# Altium project BEAGLEPLAYV020_220915.PrjPcb (part 9 of 10)

## Sheet 019_CC1352P.SchDoc
size 420 x 297 mm; Page Create Date: May 29, 2006; WebSite: https://www.seeedstudio.com; Variant Name: <Core Design>; Page Number: 19; Drawing: qxn; Schematic Name: BeaglePlay; Page Size: A3; Comment: Seeed Title; Page Count: 22; Page Name: 019_CC1352P; Company: Seeed Studio; RevCode: v0.2; DsnPath: C:\Users\a0488739\Documents\GitHub\beagleplay\allegro\DVT\BEAGLEPLAYV020_220915.DSN; SchematicName: BeaglePlay; PageName: 019_CC1352P; PageSize: A3; TopSchematic: True
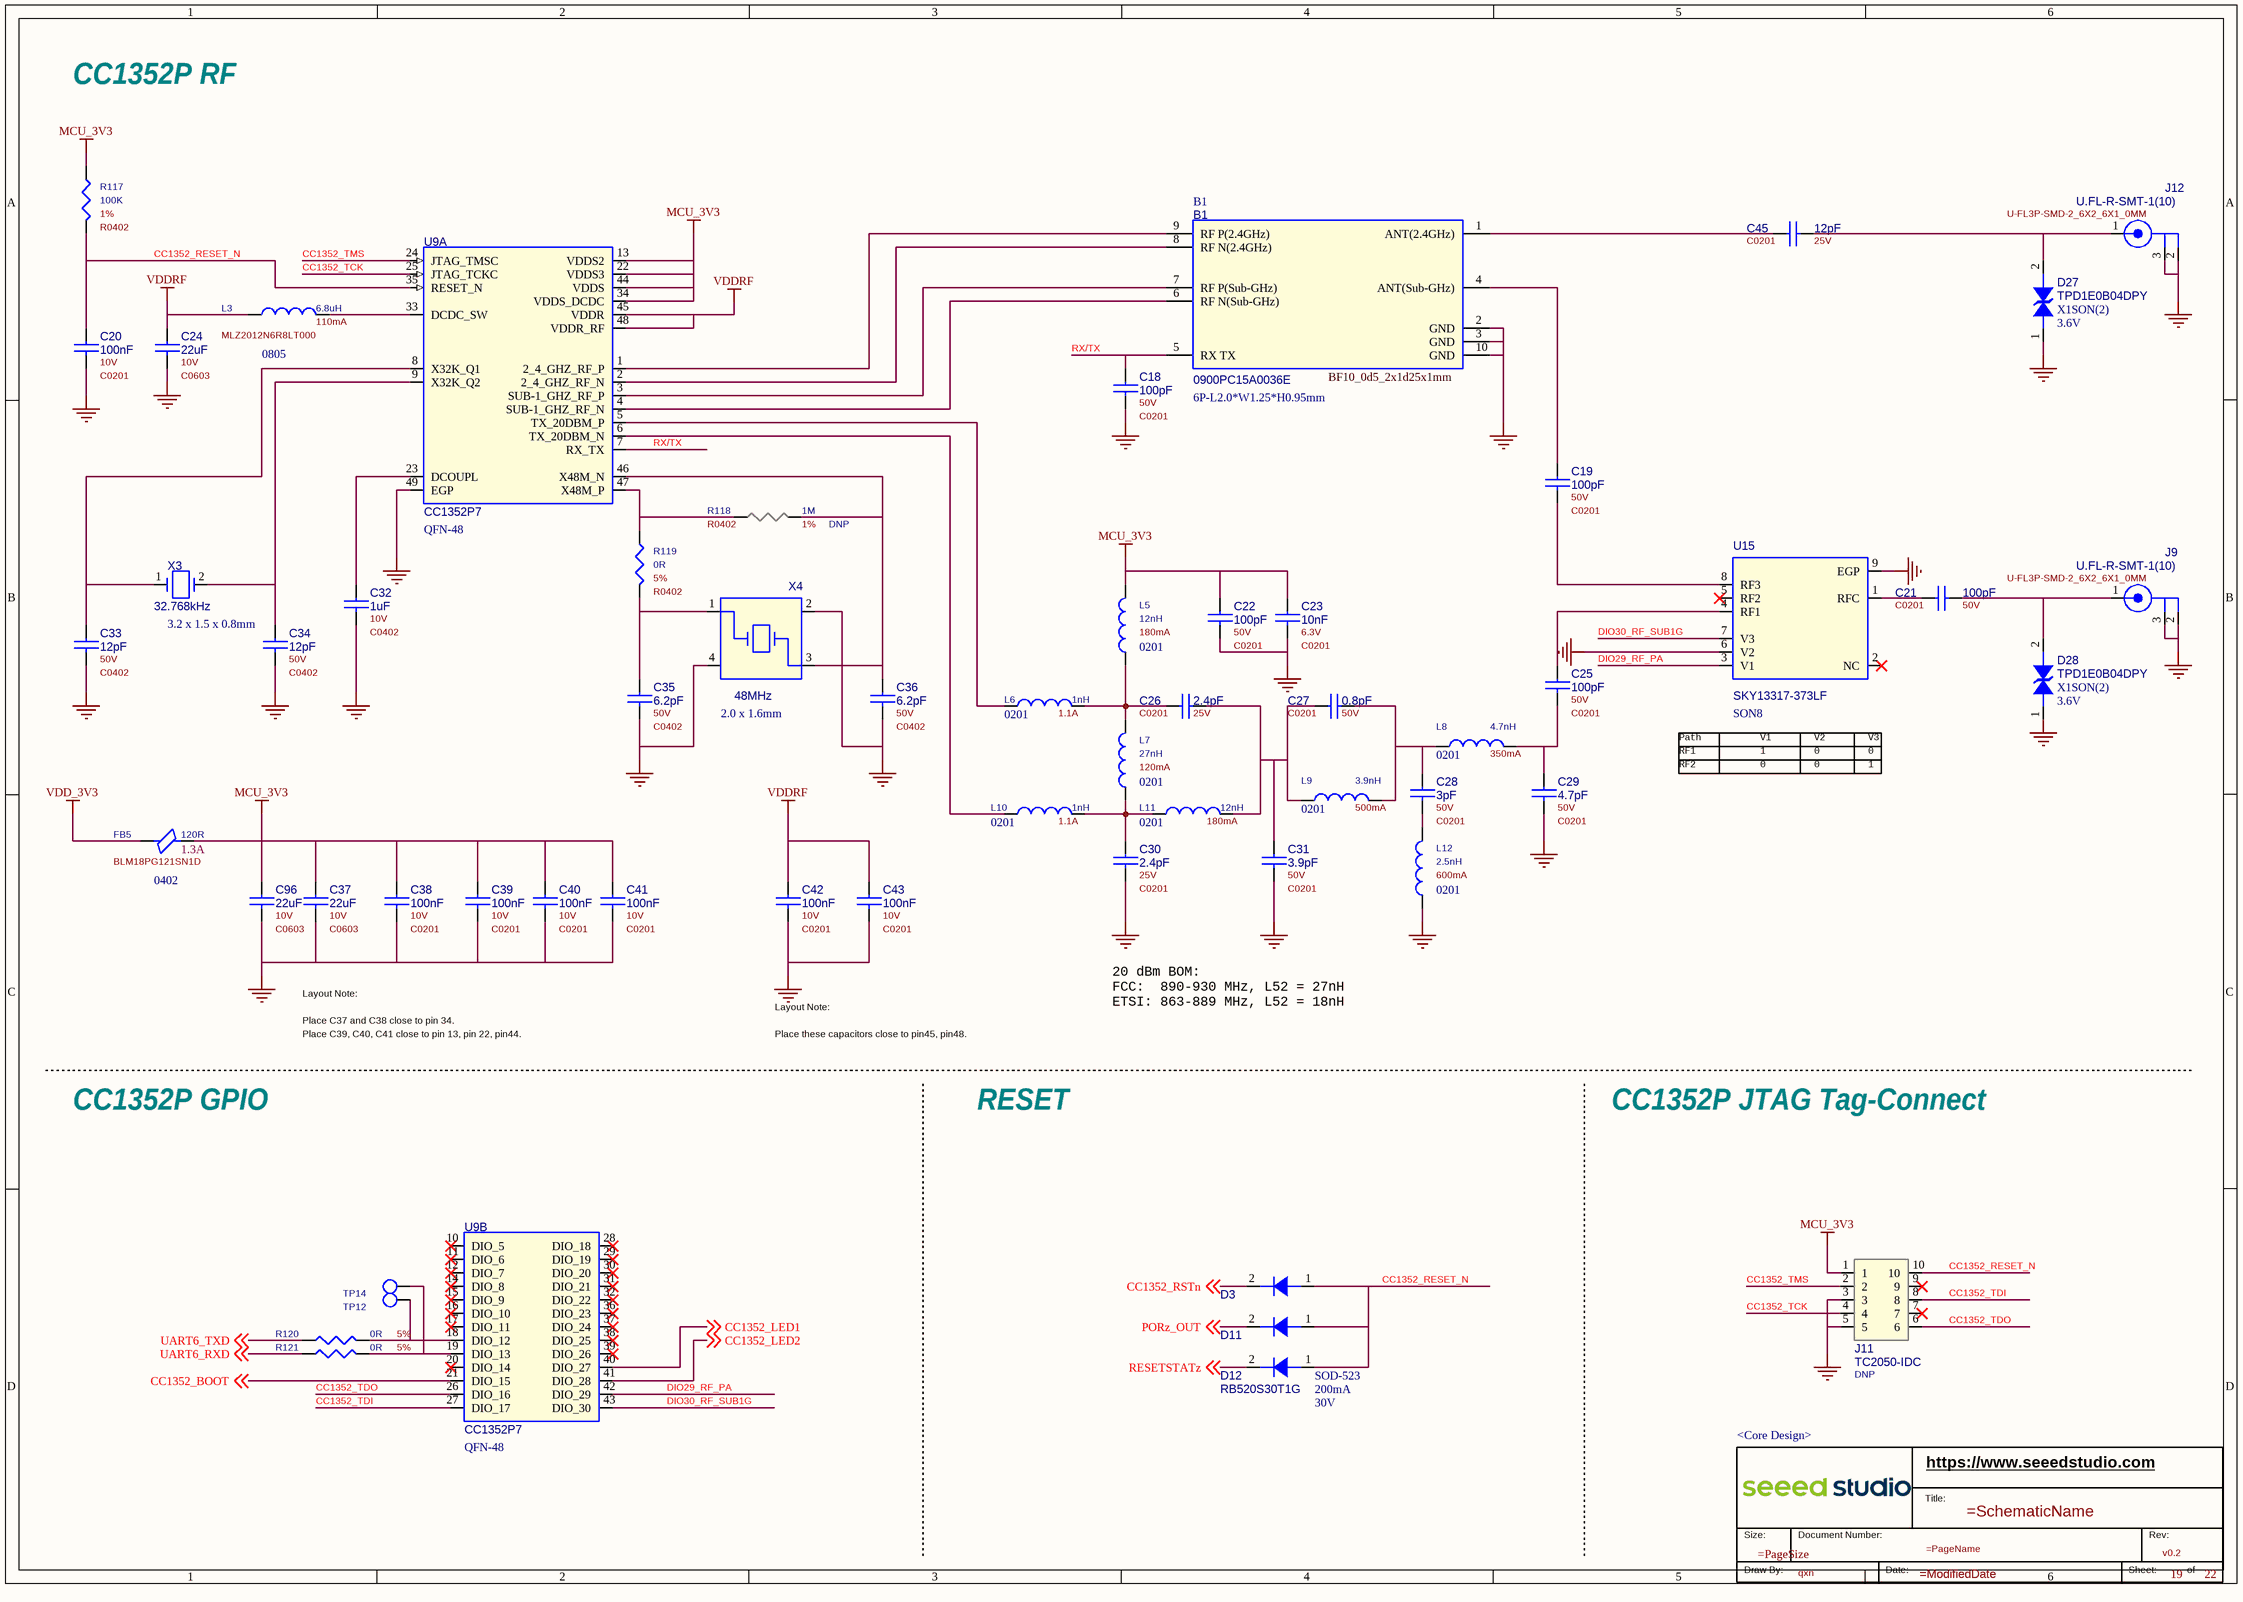
[diagram p18: 019_CC1352P.SchDoc]

### Parts
(Parts that share a designator on the sheet are numbered #1, #2 ... from top to bottom, then left to right.)
*#19  RevCode: v0.2  Page Number: 19  Page Count: 22  Drawing: qxn  Variant Name: <Core Design>  (hidden comment: Seeed Title)  (graphical)
B1  Reference: B1  Package Size: 6P-L2.0*W1.25*H0.95mm  [BF10_0d5_2x1d25x1mm]  (hidden comment: 0900PC15A0036E)
C18  value 100pF  Rating: 50V  [C0201]  (hidden comment: CC)
C19  value 100pF  Rating: 50V  [C0201]  (hidden comment: CC)
C20  value 100nF  Rating: 10V  [C0201]  (hidden comment: CC)
C21  value 100pF  Rating: 50V  [C0201]  (hidden comment: CC)
C22  value 100pF  Rating: 50V  [C0201]  (hidden comment: CC)
C23  value 10nF  Rating: 6.3V  [C0201]  (hidden comment: CC)
C24  value 22uF  Rating: 10V  [C0603]  (hidden comment: CC)
C25  value 100pF  Rating: 50V  [C0201]  (hidden comment: CC)
C26  value 2.4pF  Rating: 25V  [C0201]  (hidden comment: CC)
C27  value 0.8pF  Rating: 50V  [C0201]  (hidden comment: CC)
C28  value 3pF  Rating: 50V  [C0201]  (hidden comment: CC)
C29  value 4.7pF  Rating: 50V  [C0201]  (hidden comment: CC)
C30  value 2.4pF  Rating: 25V  [C0201]  (hidden comment: CC)
C31  value 3.9pF  Rating: 50V  [C0201]  (hidden comment: CC)
C32  value 1uF  Rating: 10V  [C0402]  (hidden comment: CC)
C33  value 12pF  Rating: 50V  [C0402]  (hidden comment: CC)
C34  value 12pF  Rating: 50V  [C0402]  (hidden comment: CC)
C35  value 6.2pF  Rating: 50V  [C0402]  (hidden comment: CC)
C36  value 6.2pF  Rating: 50V  [C0402]  (hidden comment: CC)
C37  value 22uF  Rating: 10V  [C0603]  (hidden comment: CC)
C38  value 100nF  Rating: 10V  [C0201]  (hidden comment: CC)
C39  value 100nF  Rating: 10V  [C0201]  (hidden comment: CC)
C40  value 100nF  Rating: 10V  [C0201]  (hidden comment: CC)
C41  value 100nF  Rating: 10V  [C0201]  (hidden comment: CC)
C42  value 100nF  Rating: 10V  [C0201]  (hidden comment: CC)
C43  value 100nF  Rating: 10V  [C0201]  (hidden comment: CC)
C45  value 12pF  Rating: 25V  [C0201]  (hidden comment: CC)
C96  value 22uF  Rating: 10V  [C0603]  (hidden comment: CC)
D3  D  [sod_523]  (value not drawn)
D11  D  [sod_523]  (value not drawn)
D12  value RB520S30T1G  Package Size: SOD-523  Peak Forward Current: 200mA  Repetitive Reverse Voltage Maximum: 30V  [sod_523]  (hidden comment: D)
D27  value TPD1E0B04DPY  Package Size: X1SON(2)  Rated Voltage: 3.6V  [x1son2_0d65_1x0_6x0_45mm]  (hidden comment: DIODE TVS BI-DIR)
D28  value TPD1E0B04DPY  Package Size: X1SON(2)  Rated Voltage: 3.6V  [x1son2_0d65_1x0_6x0_45mm]  (hidden comment: DIODE TVS BI-DIR)
FB5  value 120R  Rating: 1.3A  Manufacturer Part Number: BLM18PG121SN1D  Package Size: 0402  [L0402]  (hidden comment: FB)
J9  value U.FL-R-SMT-1(10)  [U-FL3P-SMD-2_6X2_6X1_0MM]  (hidden comment: RF ANT 3P)
J11  value TC2050-IDC  ASSY: DNP  [Connect10_1d27_12_4x6_7mm]  (hidden comment: Header 2X5_1)
J12  value U.FL-R-SMT-1(10)  [U-FL3P-SMD-2_6X2_6X1_0MM]  (hidden comment: RF ANT 3P)
L3  value 6.8uH  Manufacturer Part Number: MLZ2012N6R8LT000  Rating: 110mA  Package Size: 0805  [L0805]  (hidden comment: L)
L5  value 12nH  Rating: 180mA  Package Size: 0201  [L0201]  (hidden comment: L)
L6  value 1nH  Rating: 1.1A  Package Size: 0201  [L0201]  (hidden comment: L)
L7  value 27nH  Rating: 120mA  Package Size: 0201  [L0201]  (hidden comment: L)
L8  value 4.7nH  Rating: 350mA  Package Size: 0201  [L0201]  (hidden comment: L)
L9  value 3.9nH  Rating: 500mA  Package Size: 0201  [L0201]  (hidden comment: L)
L10  value 1nH  Rating: 1.1A  Package Size: 0201  [L0201]  (hidden comment: L)
L11  value 12nH  Rating: 180mA  Package Size: 0201  [L0201]  (hidden comment: L)
L12  value 2.5nH  Rating: 600mA  Package Size: 0201  [L0201]  (hidden comment: L)
R117  value 100K  Rating: 1%  [R0402]  (hidden comment: R)
R118  value 1M  Rating: 1%  ASSY: DNP  [R0402]  (hidden comment: R)
R119  value 0R  Rating: 5%  [R0402]  (hidden comment: R)
R120  value 0R  Rating: 5%  [R0402]  (hidden comment: R)
R121  value 0R  Rating: 5%  [R0402]  (hidden comment: R)
TP12  Test Point  [tp1-8040]  (value not drawn)
TP14  Test Point  [tp1-8040]  (value not drawn)
U9  value CC1352P7  Package Size: QFN-48  [qfn48_0d5_7x7mm]  (hidden comment: CC1352P1F3RGZ)  (parts A,B of 2)
U15  Package Size: SON8  [son8p_150x150x50mm]  (hidden comment: SKY13317-373LF)
X3  value 32.768kHz  Package Size: 3.2 x 1.5 x 0.8mm  [X2_SMD_3_2X1_5MM]  (hidden comment: XTAL_2P)
X4  value 48MHz  Package Size: 2.0 x 1.6mm  [x4_smd_2_0x1_6mm]  (hidden comment: XTAL_4P)

### Nets
GND: B1.2(GND) B1.3(GND) B1.10(GND) C18.2 C20.2 C22.2 C23.2 C24.2 C29.2 C30.2 C31.2 C32.2 C33.2 C34.2 C35.2 C36.2 C37.2 C38.2 C39.2 C40.2 C41.2 C42.2 C43.2 C96.2 D27.1 D28.1 J9.2(SHIELD1) J9.3(SHIELD2) J11.3 J11.5 J12.2(SHIELD1) J12.3(SHIELD2) L12.1 U9.49(EGP) U15.6(V2) U15.9(EGP) X4.2 X4.4
MCU_3V3: C22.1 C23.1 C37.1 C38.1 C39.1 C40.1 C41.1 C96.1 FB5.2 J11.1 L5.2 R117.1 U9.13(VDDS2) U9.22(VDDS3) U9.34(VDDS_DCDC) U9.44(VDDS)
VDD_3V3: FB5.1
VDDRF: C24.1 C42.1 C43.1 L3.1 U9.45(VDDR) U9.48(VDDR_RF)
CC1352_BOOT: U9.21(DIO_15) ; off-sheet CC1352_BOOT
CC1352_LED1: U9.40(DIO_27) ; off-sheet CC1352_LED1
CC1352_LED2: U9.41(DIO_28) ; off-sheet CC1352_LED2
CC1352_RESET_N: C20.1 D3.1(A) D11.1(A) D12.1(A) J11.10 R117.2 U9.35(RESET_N)
CC1352_RSTn: D3.2(C) ; off-sheet CC1352_RSTn
CC1352_TCK: J11.4 U9.25(JTAG_TCKC)
CC1352_TDI: J11.8 U9.27(DIO_17)
CC1352_TDO: J11.6 U9.26(DIO_16)
CC1352_TMS: J11.2 U9.24(JTAG_TMSC)
DIO29_RF_PA: U9.42(DIO_29) U15.3(V1)
DIO30_RF_SUB1G: U9.43(DIO_30) U15.7(V3)
PORz_OUT: D11.2(C) ; off-sheet PORz_OUT
RESETSTATz: D12.2(C) ; off-sheet RESETSTATz
RX/TX: B1.5(RX_TX) C18.1 U9.7(RX_TX)
UART6_RXD: R121.1 ; off-sheet UART6_RXD
UART6_TXD: R120.1 ; off-sheet UART6_TXD
NetB1_1: B1.1(ANT(2.4GHz)) C45.1
NetB1_4: B1.4(ANT(Sub-GHz)) C19.1
NetB1_6: B1.6(RF_N(Sub-GHz)) U9.4(SUB-1_GHZ_RF_N)
NetB1_7: B1.7(RF_P(Sub-GHz)) U9.3(SUB-1_GHZ_RF_P)
NetB1_8: B1.8(RF_N(2.4GHz)) U9.2(2_4_GHZ_RF_N)
NetB1_9: B1.9(RF_P(2.4GHz)) U9.1(2_4_GHZ_RF_P)
NetC19_2: C19.2 U15.8(RF3)
NetC21_1: C21.1 U15.1(RFC)
NetC21_2: C21.2 D28.2 J9.1(CENTER)
NetC25_1: C25.1 U15.4(RF1)
NetC25_2: C25.2 C29.1 L8.2
NetC26_1: C26.1 L5.1 L6.2 L7.2
NetC26_2: C26.2 C27.1 C31.1 L9.1 L11.2
NetC27_2: C27.2 C28.1 L8.1 L9.2
NetC28_2: C28.2 L12.2
NetC30_1: C30.1 L7.1 L10.2 L11.1
NetC32_1: C32.1 U9.23(DCOUPL)
NetC33_1: C33.1 U9.8(X32K_Q1) X3.1
NetC34_1: C34.1 U9.9(X32K_Q2) X3.2
NetC35_1: C35.1 R119.2 X4.1
NetC36_1: C36.1 R118.2 U9.46(X48M_N) X4.3
NetC45_2: C45.2 D27.2 J12.1(CENTER)
NetL3_2: L3.2 U9.33(DCDC_SW)
NetL6_1: L6.1 U9.5(TX_20DBM_P)
NetL10_1: L10.1 U9.6(TX_20DBM_N)
NetR118_1: R118.1 R119.1 U9.47(X48M_P)
NetR120_2: R120.2 TP12.1(TP) U9.18(DIO_12)
NetR121_2: R121.2 TP14.1(TP) U9.19(DIO_13)

Not connected (* = marked no-connect by the designer): J11 7* 9*; U9 10(DIO_5)* 11(DIO_6)* 12(DIO_7)* 14(DIO_8)* 15(DIO_9)* 16(DIO_10)* 17(DIO_11)* 20(DIO_14)* 28(DIO_18)* 29(DIO_19)* 30(DIO_20)* 31(DIO_21)* 32(DIO_22)* 36(DIO_23)* 37(DIO_24)* 38(DIO_25)* 39(DIO_26)*; U15 2(NC)* 5(RF2)*

### Notes on the sheet
- CC1352P RF
- Path
- RF1
- RF2
- V1
- 0
- 1
- V2
- V3
- Layout Note:
- 20 dBm BOM:
  FCC:  890-930 MHz, L52 = 27nH
  ETSI: 863-889 MHz, L52 = 18nH
- Place C39, C40, C41 close to pin 13, pin 22, pin44.
- Place C37 and C38 close to pin 34.
- Place these capacitors close to pin45, pin48.
- CC1352P GPIO
- RESET
- CC1352P JTAG Tag-Connect
- (in symbol Seeed Title) https://www.seeedstudio.com; Title:; Size:; Document Number:; Rev:; Draw By:; Date:; Sheet:; of

### Library data of the parts
*#19 = Seeed Title: Company: Seeed Studio; WebSite: https://www.seeedstudio.com; Schematic Name: =SchematicName; Page Size: =PageSize; Page Name: =PageName; Page Create Date: May 29, 2006; Page Modify Date: =ModifiedDate
B1 = 0900PC15A0036E: MISC, Balun, 0900PC15A0036E, SMD, 6P-L2.0*W1.25*H0.95mm; Manufacturer: Johanson; Company Part Status: BeaglePlay; PN: 310060581; CLASS: DISCRETE; PCB Footprint: BF10_0d5_2x1d25x1mm; Value: 0900PC15A0036E; Part Reference: B1; Manufacturer Part Number: 0900PC15A0036E; Manufacturer PN: 0900PC15A0036E
C18 = CC: CAP, Ceramic, SMD, 100pF, 5%, 50V, 0201; Part Reference: C18; Manufacturer PN: CC0201JRNPO9BN101; Company Part Status: BeaglePlay; Manufacturer Part Number: CC0402JRNPO9BN101; Manufacturer: YAGEO; CLASS: DISCRETE; PN: 302010420; Temperature Coefficient: NPO; PCB Footprint: C0201; Tolerance: 5%; Dielectric Type: Ceramic; Package Size: 0201; Temperature: -55¡ãC to 125¡ãC; Status: Testo PoE; Part Type: Ceramic
C19 = CC: CAP, Ceramic, SMD, 100pF, 5%, 50V, 0201; Part Reference: C19; Manufacturer: YAGEO; Manufacturer Part Number: CC0402JRNPO9BN101; Company Part Status: BeaglePlay; Manufacturer PN: CC0201JRNPO9BN101; Temperature Coefficient: NPO; PN: 302010420; CLASS: DISCRETE; PCB Footprint: C0201; Part Type: Ceramic; Status: Testo PoE; Temperature: -55¡ãC to 125¡ãC; Package Size: 0201; Dielectric Type: Ceramic; Tolerance: 5%
C20 = CC: CAP, Ceramic, SMD, 100nF, 10%, 10V, 0201; Part Reference: C20; Manufacturer PN: CC0201KRX5R6BB104; Company Part Status: ODYSSEY-i.MX8M; Manufacturer Part Number: CC0402KRX7R7BB104; Manufacturer: YAGEO; CLASS: DISCRETE; Temperature Coefficient: X5R; PN: 302010271; PCB Footprint: C0201; Tolerance: 10%; Dielectric Type: Ceramic; Package Size: 0201; Temperature: -55¡ãC to 125¡ãC; Status: BeagleBone Carrier Board; Part Type: Ceramic
C21 = CC: CAP, Ceramic, SMD, 100pF, 5%, 50V, 0201; Part Reference: C21; Manufacturer PN: CC0201JRNPO9BN101; Company Part Status: BeaglePlay; Manufacturer Part Number: CC0402JRNPO9BN101; Manufacturer: YAGEO; CLASS: DISCRETE; PN: 302010420; Temperature Coefficient: NPO; PCB Footprint: C0201; Tolerance: 5%; Dielectric Type: Ceramic; Package Size: 0201; Temperature: -55¡ãC to 125¡ãC; Status: Testo PoE; Part Type: Ceramic
C22 = CC: CAP, Ceramic, SMD, 100pF, 5%, 50V, 0201; Part Reference: C22; Manufacturer PN: CC0201JRNPO9BN101; Company Part Status: BeaglePlay; Manufacturer Part Number: CC0402JRNPO9BN101; Manufacturer: YAGEO; CLASS: DISCRETE; PN: 302010420; Temperature Coefficient: NPO; PCB Footprint: C0201; Tolerance: 5%; Dielectric Type: Ceramic; Package Size: 0201; Temperature: -55¡ãC to 125¡ãC; Status: Testo PoE; Part Type: Ceramic
C23 = CC: CAP, Ceramic, SMD, 10nF, 10%, 6.3V, 0201; Part Reference: C23; Manufacturer PN: CC0201KRX5R5BB103; Company Part Status: ODYSSEY-i.MX8M; Manufacturer: YAGEO; Manufacturer Part Number: CC0402KRX7R9BB103; CLASS: DISCRETE; Temperature Coefficient: X5R; PN: 302011831; PCB Footprint: C0201; Tolerance: 10%; Dielectric Type: Ceramic; Package Size: 0201; Part Type: Ceramic; Status: BeagleBone Carrier Board; Temperature: -55¡ãC to 125¡ãC
C24 = CC: CAP, Ceramic, SMD, 22uF, 20%, 10V, 0603; Part Reference: C24; Manufacturer PN: CC0603MRX5R6BB226; Manufacturer: YAGEO; CLASS: DISCRETE; Temperature Coefficient: X5R; PN: 302010411; PCB Footprint: C0603; Tolerance: 20%; Dielectric Type: Ceramic; Package Size: 0603; Manufacturer Part Number: CC0603MRX5R6BB226; Part Type: Ceramic; Temperature: -55¡ãC to 85¡ãC
C25 = CC: CAP, Ceramic, SMD, 100pF, 5%, 50V, 0201; Part Reference: C25; Manufacturer PN: CC0201JRNPO9BN101; Company Part Status: BeaglePlay; Manufacturer Part Number: CC0402JRNPO9BN101; Manufacturer: YAGEO; CLASS: DISCRETE; PN: 302010420; Temperature Coefficient: NPO; PCB Footprint: C0201; Tolerance: 5%; Dielectric Type: Ceramic; Package Size: 0201; Temperature: -55¡ãC to 125¡ãC; Status: Testo PoE; Part Type: Ceramic
C26 = CC: CAP, Ceramic, SMD, 2.4pF, 0.25pF, 25V, 0201; Part Reference: C26; Manufacturer PN: GJM0335C1E2R4CB01D; Company Part Status: BeaglePlay; Manufacturer: Murata; Manufacturer Part Number: CC0402CRNPO9BN2R4; CLASS: DISCRETE; Temperature Coefficient: COG; PN: 302012904; PCB Footprint: C0201; Tolerance: 0.25pF; Dielectric Type: Ceramic; Package Size: 0201; Part Type: Ceramic; Status: Amazon Sidewalk Module; Temperature: -55¡ãC to 125¡ãC
C27 = CC: CAP, Ceramic, SMD, 0.8pF, 0.01pF, 50V, 0201; Part Reference: C27; Manufacturer PN: GRM0335C1HR80BA01D; Company Part Status: BeaglePlay; Manufacturer Part Number: CC0402BRNPO9BNR80; Manufacturer: Murata; CLASS: DISCRETE; Temperature Coefficient: COG; PN: 302011837; PCB Footprint: C0201; Tolerance: 0.01pF; Dielectric Type: Ceramic; Package Size: 0201; Temperature: -55¡ãC to 125¡ãC; Status: Amazon Sidewalk Module; Part Type: Ceramic
C28 = CC: CAP, Ceramic, SMD, 3pF, 0.1pF, 50V, 0201; Part Reference: C28; Manufacturer PN: CC0201BRNPO9BN3R0; Company Part Status: LR1110; Manufacturer Part Number: GRM1555C1H3R0WA01D; Manufacturer: YAGEO; CLASS: DISCRETE; Temperature Coefficient: NPO; PN: 302013024; PCB Footprint: C0201; Tolerance: 0.1pF; Dielectric Type: Ceramic; Package Size: 0201; Temperature: -55¡ãC to 125¡ãC; Status: Zola Dongle; Part Type: Ceramic
C29 = CC: CAP, Ceramic, SMD, 4.7pF, 0.25pF, 50V, 0201; Part Reference: C29; Manufacturer PN: GJM0335C1H4R7BB01D; Company Part Status: BeaglePlay; Manufacturer: Murata; Manufacturer Part Number: CC0402CRNPO9BN4R7; CLASS: DISCRETE; Temperature Coefficient: COG; PN: 302012908; PCB Footprint: C0201; Tolerance: 0.25pF; Dielectric Type: Ceramic; Package Size: 0201; Part Type: Ceramic; Status: Mini-Gateway; Temperature: -55¡ãC to 125¡ãC
C30 = CC: CAP, Ceramic, SMD, 2.4pF, 0.25pF, 25V, 0201; Part Reference: C30; Manufacturer PN: GJM0335C1E2R4CB01D; Company Part Status: BeaglePlay; Manufacturer: Murata; Manufacturer Part Number: CC0402CRNPO9BN2R4; CLASS: DISCRETE; Temperature Coefficient: COG; PN: 302012904; PCB Footprint: C0201; Tolerance: 0.25pF; Dielectric Type: Ceramic; Package Size: 0201; Part Type: Ceramic; Status: Amazon Sidewalk Module; Temperature: -55¡ãC to 125¡ãC
C31 = CC: CAP, Ceramic, SMD, 3.9pF, 0.1pF, 50V, 0201; Part Reference: C31; Manufacturer PN: GJM0335C1H3R9BB01D; Company Part Status: BeaglePlay; Manufacturer Part Number: GJM1555C1H3R9BB01D; Manufacturer: Murata; CLASS: DISCRETE; Temperature Coefficient: COG; PN: 302012906; PCB Footprint: C0201; Tolerance: 0.1pF; Dielectric Type: Ceramic; Package Size: 0201; Temperature: -55¡ãC to 125¡ãC; Status: Amazon Sidewalk Module; Part Type: Ceramic
C32 = CC: CAP, Ceramic, SMD, 1uF, 10%, 10V, 0402; Part Reference: C32; Manufacturer PN: CC0402KRX5R6BB105; Company Part Status: BeagleBone Carrier Board; Manufacturer: YAGEO; CLASS: DISCRETE; Temperature Coefficient: X5R; PN: 302010040; PCB Footprint: C0402; Tolerance: 10%; Dielectric Type: Ceramic; Package Size: 0402; Manufacturer Part Number: CC0402KRX5R6BB105; Part Type: Ceramic; Status: BeagleBone Carrier Board; Temperature: -55¡ãC to 85¡ãC
C33 = CC: CAP, Ceramic, SMD, 12pF, 5%, 50V, 0402; Part Reference: C33; Manufacturer PN: CC0402JRNPO9BN120; Company Part Status: BeaglePlay; Manufacturer: YAGEO; CLASS: DISCRETE; Temperature Coefficient: NPO; PN: 302010049; PCB Footprint: C0402; Tolerance: 5%; Dielectric Type: Ceramic; Package Size: 0402; Temperature: -55¡ãC to 125¡ãC; Status: Testo PoE; Part Type: Ceramic; Manufacturer Part Number: CC0402JRNPO9BN120
C34 = CC: CAP, Ceramic, SMD, 12pF, 5%, 50V, 0402; Part Reference: C34; Manufacturer PN: CC0402JRNPO9BN120; Company Part Status: BeaglePlay; Manufacturer: YAGEO; CLASS: DISCRETE; Temperature Coefficient: NPO; PN: 302010049; PCB Footprint: C0402; Tolerance: 5%; Dielectric Type: Ceramic; Package Size: 0402; Temperature: -55¡ãC to 125¡ãC; Status: Testo PoE; Part Type: Ceramic; Manufacturer Part Number: CC0402JRNPO9BN120
C35 = CC: CAP, Ceramic, SMD, 6.2pF, 0.25pF, 50V, 0402; Part Reference: C35; Manufacturer PN: GJM1555C1H6R2CB01D; Company Part Status: BeaglePlay; Manufacturer: Murata; CLASS: DISCRETE; Temperature Coefficient: C0G; PN: 302010303; PCB Footprint: C0402; Tolerance: 0.25pF; Dielectric Type: Ceramic; Package Size: 0402; Manufacturer Part Number: GJM1555C1H6R2CB01D; Part Type: Ceramic; Status: Zola Dongle; Temperature: -55¡ãC to 125¡ãC
C36 = CC: CAP, Ceramic, SMD, 6.2pF, 0.25pF, 50V, 0402; Part Reference: C36; Manufacturer PN: GJM1555C1H6R2CB01D; Company Part Status: BeaglePlay; Manufacturer: Murata; CLASS: DISCRETE; Temperature Coefficient: C0G; PN: 302010303; PCB Footprint: C0402; Tolerance: 0.25pF; Dielectric Type: Ceramic; Package Size: 0402; Manufacturer Part Number: GJM1555C1H6R2CB01D; Part Type: Ceramic; Status: Zola Dongle; Temperature: -55¡ãC to 125¡ãC
C37 = CC: CAP, Ceramic, SMD, 22uF, 20%, 10V, 0603; Part Reference: C37; Manufacturer PN: CC0603MRX5R6BB226; Manufacturer: YAGEO; CLASS: DISCRETE; Temperature Coefficient: X5R; PN: 302010411; PCB Footprint: C0603; Tolerance: 20%; Dielectric Type: Ceramic; Package Size: 0603; Manufacturer Part Number: CC0603MRX5R6BB226; Part Type: Ceramic; Temperature: -55¡ãC to 85¡ãC
C38 = CC: CAP, Ceramic, SMD, 100nF, 10%, 10V, 0201; Part Reference: C38; Manufacturer PN: CC0201KRX5R6BB104; Company Part Status: ODYSSEY-i.MX8M; Manufacturer: YAGEO; Manufacturer Part Number: CC0402KRX7R7BB104; CLASS: DISCRETE; Temperature Coefficient: X5R; PN: 302010271; PCB Footprint: C0201; Tolerance: 10%; Dielectric Type: Ceramic; Package Size: 0201; Part Type: Ceramic; Status: BeagleBone Carrier Board; Temperature: -55¡ãC to 125¡ãC
C39 = CC: CAP, Ceramic, SMD, 100nF, 10%, 10V, 0201; Part Reference: C39; Manufacturer PN: CC0201KRX5R6BB104; Company Part Status: ODYSSEY-i.MX8M; Manufacturer Part Number: CC0402KRX7R7BB104; Manufacturer: YAGEO; CLASS: DISCRETE; Temperature Coefficient: X5R; PN: 302010271; PCB Footprint: C0201; Tolerance: 10%; Dielectric Type: Ceramic; Package Size: 0201; Temperature: -55¡ãC to 125¡ãC; Status: BeagleBone Carrier Board; Part Type: Ceramic
C40 = CC: CAP, Ceramic, SMD, 100nF, 10%, 10V, 0201; Part Reference: C40; Manufacturer PN: CC0201KRX5R6BB104; Company Part Status: ODYSSEY-i.MX8M; Manufacturer Part Number: CC0402KRX7R7BB104; Manufacturer: YAGEO; CLASS: DISCRETE; Temperature Coefficient: X5R; PN: 302010271; PCB Footprint: C0201; Tolerance: 10%; Dielectric Type: Ceramic; Package Size: 0201; Temperature: -55¡ãC to 125¡ãC; Status: BeagleBone Carrier Board; Part Type: Ceramic
C41 = CC: CAP, Ceramic, SMD, 100nF, 10%, 10V, 0201; Part Reference: C41; Manufacturer PN: CC0201KRX5R6BB104; Company Part Status: ODYSSEY-i.MX8M; Manufacturer Part Number: CC0402KRX7R7BB104; Manufacturer: YAGEO; CLASS: DISCRETE; Temperature Coefficient: X5R; PN: 302010271; PCB Footprint: C0201; Tolerance: 10%; Dielectric Type: Ceramic; Package Size: 0201; Temperature: -55¡ãC to 125¡ãC; Status: BeagleBone Carrier Board; Part Type: Ceramic
C42 = CC: CAP, Ceramic, SMD, 100nF, 10%, 10V, 0201; Part Reference: C42; Manufacturer: YAGEO; Manufacturer Part Number: CC0402KRX7R7BB104; Company Part Status: ODYSSEY-i.MX8M; Manufacturer PN: CC0201KRX5R6BB104; PN: 302010271; Temperature Coefficient: X5R; CLASS: DISCRETE; PCB Footprint: C0201; Part Type: Ceramic; Status: BeagleBone Carrier Board; Temperature: -55¡ãC to 125¡ãC; Package Size: 0201; Dielectric Type: Ceramic; Tolerance: 10%
C43 = CC: CAP, Ceramic, SMD, 100nF, 10%, 10V, 0201; Part Reference: C43; Manufacturer Part Number: CC0402KRX7R7BB104; Manufacturer: YAGEO; Company Part Status: ODYSSEY-i.MX8M; Manufacturer PN: CC0201KRX5R6BB104; PN: 302010271; Temperature Coefficient: X5R; CLASS: DISCRETE; PCB Footprint: C0201; Temperature: -55¡ãC to 125¡ãC; Status: BeagleBone Carrier Board; Part Type: Ceramic; Package Size: 0201; Dielectric Type: Ceramic; Tolerance: 10%
C45 = CC: CAP, Ceramic, SMD, 12pF, 5%, 25V, 0201; Part Reference: C45; Manufacturer PN: CC0201JRNPO8BN120; Company Part Status: BeaglePlay; Manufacturer Part Number: CC0402JRNPO9BN101; Manufacturer: YAGEO; CLASS: DISCRETE; PN: 302010424; Temperature Coefficient: NPO; PCB Footprint: C0201; Tolerance: 5%; Dielectric Type: Ceramic; Package Size: 0201; Temperature: -55¡ãC to 125¡ãC; Status: Testo PoE; Part Type: Ceramic
C96 = CC: CAP, Ceramic, SMD, 22uF, 20%, 10V, 0603; Part Reference: C96; Manufacturer PN: CC0603MRX5R6BB226; Manufacturer: YAGEO; CLASS: DISCRETE; Temperature Coefficient: X5R; PN: 302010411; PCB Footprint: C0603; Tolerance: 20%; Dielectric Type: Ceramic; Package Size: 0603; Manufacturer Part Number: CC0603MRX5R6BB226; Part Type: Ceramic; Temperature: -55¡ãC to 85¡ãC
D3 = D: DIO, Schottky, RB520S30T1G, , , , SOD-523; Part Reference: D3; Manufacturer: ON; Company Part Status: SCG Vehicle Device; CLASS: DISCRETE; Repetitive Reverse Voltage Maximum: 30V; Peak Forward Current: 200mA; PN: 304020782; PCB Footprint: sod_523; Value: RB520S30T1G; Manufacturer PN: RB520S30T1G; Package Size: SOD-523
D11 = D: DIO, Schottky, RB520S30T1G, , , , SOD-523; Part Reference: D11; Manufacturer: ON; Company Part Status: SCG Vehicle Device; CLASS: DISCRETE; Repetitive Reverse Voltage Maximum: 30V; Peak Forward Current: 200mA; PN: 304020782; PCB Footprint: sod_523; Value: RB520S30T1G; Manufacturer PN: RB520S30T1G; Package Size: SOD-523
D12 = D: DIO, Schottky, RB520S30T1G, , , , SOD-523; Part Reference: D12; Company Part Status: SCG Vehicle Device; Manufacturer: ON; PN: 304020782; CLASS: DISCRETE; PCB Footprint: sod_523; Manufacturer PN: RB520S30T1G
D27 = DIODE TVS BI-DIR: DIO, ESD, TPD1E0B04DPY, --, 3.6V, --, X1SON(2); Part Reference: D27; Company Part Status: BeaglePlay; Manufacturer: TI; Manufacturer PN: TPD1E0B04DPYR; PN: 304051038; CLASS: DISCRETE; PCB Footprint: x1son2_0d65_1x0_6x0_45mm
D28 = DIODE TVS BI-DIR: DIO, ESD, TPD1E0B04DPY, --, 3.6V, --, X1SON(2); Part Reference: D28; Company Part Status: BeaglePlay; Manufacturer: TI; Manufacturer PN: TPD1E0B04DPYR; PN: 304051038; CLASS: DISCRETE; PCB Footprint: x1son2_0d65_1x0_6x0_45mm
FB5 = FB: Ferrite Bead, 120R, , 1.3A, 0402; Part Reference: FB5; Manufacturer: Murata; Company Part Status: BeagleBone Carrier Board; Manufacturer PN: BLM15PD121SN1D; PN: 303030040; CLASS: DISCRETE; PCB Footprint: L0402; Part Type: Ferrite Bead; Status: BeagleBone Carrier Board; Temperature: -55¡ãC to 125¡ãC
J9 = RF ANT 3P: CONN, RF Connector, 3P, SMD; Part Reference: J9; Manufacturer: HRS; Company Part Status: Seeed BeagleBone Green Gateway; CLASS: IO; PN: 320111077; PCB Footprint: U-FL3P-SMD-2_6X2_6X1_0MM; Manufacturer PN: U.FL-R-SMT-1(10); Package Size: 3P-L2.6*W2.6*H1.25mm
J11 = Header 2X5_1: CONN, Header, TC2050-IDC, 2*5P, SMD; Part Reference: J11; Company Part Status: RV PI; PN: TMP-43; CLASS: IO; PCB Footprint: Connect10_1d27_12_4x6_7mm
J12 = RF ANT 3P: CONN, RF Connector, 3P, SMD; Part Reference: J12; Manufacturer: HRS; Company Part Status: Seeed BeagleBone Green Gateway; CLASS: IO; PN: 320111077; PCB Footprint: U-FL3P-SMD-2_6X2_6X1_0MM; Manufacturer PN: U.FL-R-SMT-1(10); Package Size: 3P-L2.6*W2.6*H1.25mm
L3 = L: Power Inductor, 6.8uH, 20%, 110mA, 0805; Part Reference: L3; Company Part Status: BealgePlay; Manufacturer: TDK; CLASS: DISCRETE; PN: 303011320; PCB Footprint: L0805; Manufacturer PN: MLZ2012N6R8LT000; Temperature: -55¡ãC to 125¡ãC; Status: Zola Dongle; Part Type: Inductor
L5 = L: Inductor, 12nH, 3%, 180mA, 0201; Manufacturer Part Number: LQW15AN12NG00D; Part Reference: L5; Manufacturer: Murata; Company Part Status: BeaglePlay; Manufacturer PN: LQP03TG12NH02D; PN: 303011637; CLASS: DISCRETE; PCB Footprint: L0201; Part Type: Inductor; Status: Jetson Nano; Temperature: -55¡ãC to 125¡ãC
L6 = L: Inductor, 1nH, 0.05nH, 1.1A, 0201; Manufacturer Part Number: LQG15HS1N0S02D; Part Reference: L6; Manufacturer: Murata; Company Part Status: BeaglePlay; Manufacturer PN: LQP03HQ1N0W02D; PN: 303011219; CLASS: DISCRETE; PCB Footprint: L0201; Temperature: -55¡ãC to 125¡ãC; Status: Jetson Nano; Part Type: Inductor
L7 = L: Inductor, 27nH, 3%, 120mA, 0201; Manufacturer Part Number: LQW15AN18NG00; Part Reference: L7; Manufacturer: Murata; Manufacturer PN: LQP03TG27NH02D; Company Part Status: BeaglePlay; PN: 303011639; CLASS: DISCRETE; PCB Footprint: L0201; Part Type: Inductor
L8 = L: Inductor, 4.7nH, 5%, 350mA, 0201; Manufacturer Part Number: LQW15AN4N7C00D; Part Reference: L8; Manufacturer: Murata; Company Part Status: BeaglePlay; Manufacturer PN: LQP03TN4N7J02D; PN: 303010096; CLASS: DISCRETE; PCB Footprint: L0201; Part Type: Inductor; Status: Zola Dongle; Temperature: -55¡ãC to 125¡ãC
L9 = L: Inductor, 3.9nH, 0.1nH, 500mA, 0201; Manufacturer Part Number: LQW15AN3N9B00D; Part Reference: L9; Manufacturer: Murata; Company Part Status: BeaglePlay; Manufacturer PN: LQP03HQ3N9B02D; PN: 303011225; CLASS: DISCRETE; PCB Footprint: L0201; Part Type: Inductor; Status: Zola Dongle; Temperature: -55¡ãC to 125¡ãC
L10 = L: Inductor, 1nH, 0.05nH, 1.1A, 0201; Manufacturer Part Number: LQG15HS1N0S02D; Part Reference: L10; Manufacturer PN: LQP03HQ1N0W02D; Company Part Status: BeaglePlay; Manufacturer: Murata; CLASS: DISCRETE; PN: 303011219; PCB Footprint: L0201; Part Type: Inductor; Status: Jetson Nano; Temperature: -55¡ãC to 125¡ãC
L11 = L: Inductor, 12nH, 3%, 180mA, 0201; Manufacturer Part Number: LQW15AN12NG00D; Part Reference: L11; Manufacturer: Murata; Company Part Status: BeaglePlay; Manufacturer PN: LQP03TG12NH02D; PN: 303011637; CLASS: DISCRETE; PCB Footprint: L0201; Part Type: Inductor; Status: Jetson Nano; Temperature: -55¡ãC to 125¡ãC
L12 = L: Inductor, 2.5nH, 0.1nH, 600mA, 0201; Manufacturer Part Number: LQW15AN2N5B00D; Part Reference: L12; Manufacturer: Murata; Company Part Status: BeaglePlay; Manufacturer PN: LQP03HQ2N5B02D; PN: 303011636; CLASS: DISCRETE; PCB Footprint: L0201; Part Type: Inductor; Status: Amazon Sidewalk Module; Temperature: -55¡ãC to 125¡ãC
R117 = R: RES, Thick Film, 100K, 1%, 1/16W, SMD, 0402; Part Reference: R117; Manufacturer PN: RC0402FR-07100KL; Company Part Status: BeagleBone Carrier Board; Manufacturer: YAGEO; CLASS: DISCRETE; PN: 301010456; PCB Footprint: R0402; Rated Power: 1/16W; Package Size: 0402; Temperature: -55¡ãC to 155¡ãC; Status: BeagleBone Carrier Board; Part Type: RES; Manufacturer Part Number: RC0402FR-07100KL
R118 = R: RES, Thick Film, 1M, 1%, 1/16W, SMD, 0402; Part Reference: R118; Manufacturer PN: RC0402FR-071ML; Company Part Status: BeagleBone Carrier Board; Manufacturer: YAGEO; CLASS: DISCRETE; PN: 301010043; PCB Footprint: R0402; Rated Power: 1/16W; Package Size: 0402; Temperature: -55¡ãC to 155¡ãC; Status: BeagleBone Carrier Board; Part Type: RES; Manufacturer Part Number: RC0402FR-071ML
R119 = R: RES, Thick Film, 0R, 5%, 1/16W, SMD, 0402; Part Reference: R119; Manufacturer PN: RC0402JR-070RL; Company Part Status: BeagleBone Carrier Board; Manufacturer: YAGEO; CLASS: DISCRETE; PN: 301010000; PCB Footprint: R0402; Rated Power: 1/16W; Package Size: 0402; Manufacturer Part Number: RC0402JR-070RL; Part Type: RES; Status: BeagleBone Carrier Board; Temperature: -55¡ãC to 155¡ãC; Datasheet: Y:\01_Cadence_Library\05_Datasheet\301010000_YAGEO_RC0402JR-070RL_Datasheet.pdf
R120 = R: RES, Thick Film, 0R, 5%, 1/16W, SMD, 0402; Part Reference: R120; Manufacturer PN: RC0402JR-070RL; Company Part Status: BeagleBone Carrier Board; Manufacturer: YAGEO; CLASS: DISCRETE; PN: 301010000; PCB Footprint: R0402; Rated Power: 1/16W; Package Size: 0402; Datasheet: Y:\01_Cadence_Library\05_Datasheet\301010000_YAGEO_RC0402JR-070RL_Datasheet.pdf; Temperature: -55¡ãC to 155¡ãC; Status: BeagleBone Carrier Board; Part Type: RES; Manufacturer Part Number: RC0402JR-070RL
R121 = R: RES, Thick Film, 0R, 5%, 1/16W, SMD, 0402; Part Reference: R121; Manufacturer PN: RC0402JR-070RL; Company Part Status: BeagleBone Carrier Board; Manufacturer: YAGEO; CLASS: DISCRETE; PN: 301010000; PCB Footprint: R0402; Rated Power: 1/16W; Package Size: 0402; Datasheet: Y:\01_Cadence_Library\05_Datasheet\301010000_YAGEO_RC0402JR-070RL_Datasheet.pdf; Temperature: -55¡ãC to 155¡ãC; Status: BeagleBone Carrier Board; Part Type: RES; Manufacturer Part Number: RC0402JR-070RL
TP12 = Test Point: MISC, Test Point, Test Point, SMD, TP35S_SMD; Part Reference: TP12; Company Part Status: Mini-Gateway; ASSY: DNP; CLASS: DISCRETE; PCB Footprint: TP35S_SMD; Value: Test Point; Package Size: TP35S_SMD; PN: TP35S_SMD
TP14 = Test Point: MISC, Test Point, Test Point, SMD, TP35S_SMD; Part Reference: TP14; Company Part Status: Mini-Gateway; ASSY: DNP; CLASS: DISCRETE; PCB Footprint: TP35S_SMD; Value: Test Point; Package Size: TP35S_SMD; PN: TP35S_SMD
U9 = CC1352P1F3RGZ: IC, Controller, MCU, CC1352P7, QFN-48; Part Reference: U9; Manufacturer PN: CC1352P74T0RGZR; Company Part Status: BeaglePlay; Manufacturer: TI; Manufacturer Part Number: CC1352P1F3RGZT; Supply Voltage: 2.0 to 3.6V; PN: 310011579; Rating: 2.4G,SUB 1G; PCB Footprint: qfn48_0d5_7x7mm; CLASS: IC; Part Type: MCU; Status: Zola Dongle; Temperature: -40¡ãC to 85¡ãC
U15 = SKY13317-373LF: IC, Analog Devices, RF Switch, SKY13317-373LF, SON8; Part Reference: U15; Manufacturer: SKYWORKS; Company Part Status: BeaglePlay; PN: 310060642; PCB Footprint: son8p_150x150x50mm; Value: SKY13317-373LF; Temperature: -40¡ãC to 100¡ãC; Status: Zola Dongle; Part Type: Analog Switch; Manufacturer Part Number: SKY13317-373; CLASS: IC; Manufacturer PN: SKY13317-373LF
X3 = XTAL_2P: Crystal, SMD, 32.768kHz, 20 ppm, 7pF; Part Reference: X3; Manufacturer PN: FC-135 32.768KA-AG0; Company Part Status: Combox Pro; Manufacturer: EPSON; CLASS: DISCRETE; Frequency Tolerance: 20 ppm; Rating: 20ppm; PN: 306011026; PCB Footprint: X2_SMD_3_2X1_5MM; Temperature: -40¡ãC to 85¡ãC; Status: Zola Dongle; Part Type: Crystal; Manufacturer Part Number: FC-135 32.768KA-AG0
X4 = XTAL_4P: Crystal, SMD, 48MHz, 10 ppm, 7pF; Part Reference: X4; Manufacturer PN: 5NAA48000071SF50Q2; Company Part Status: MS; Manufacturer: Interquip; CLASS: DISCRETE; Frequency Tolerance: 10 ppm; Rating: 10ppm; PN: 306011062; PCB Footprint: x4_smd_2_0x1_6mm; Temperature: -40¡ãC to 85¡ãC; Status: Zola Dongle; Part Type: Crystal; Manufacturer Part Number: 5NAA48000071SF50Q2

## Sheet 020_WiFi WL1807MOD.SchDoc
size 420 x 297 mm; Page Create Date: May 29, 2006; WebSite: https://www.seeedstudio.com; Variant Name: <Core Design>; Page Number: 20; Drawing: qxn; Schematic Name: BeaglePlay; Page Size: A3; Comment: Seeed Title; Page Count: 22; Page Name: 020_WiFi WL1807MOD; Company: Seeed Studio; RevCode: v0.2; DsnPath: C:\Users\a0488739\Documents\GitHub\beagleplay\allegro\DVT\BEAGLEPLAYV020_220915.DSN; SchematicName: BeaglePlay; PageName: 020_WiFi WL1807MOD; PageSize: A3; TopSchematic: True
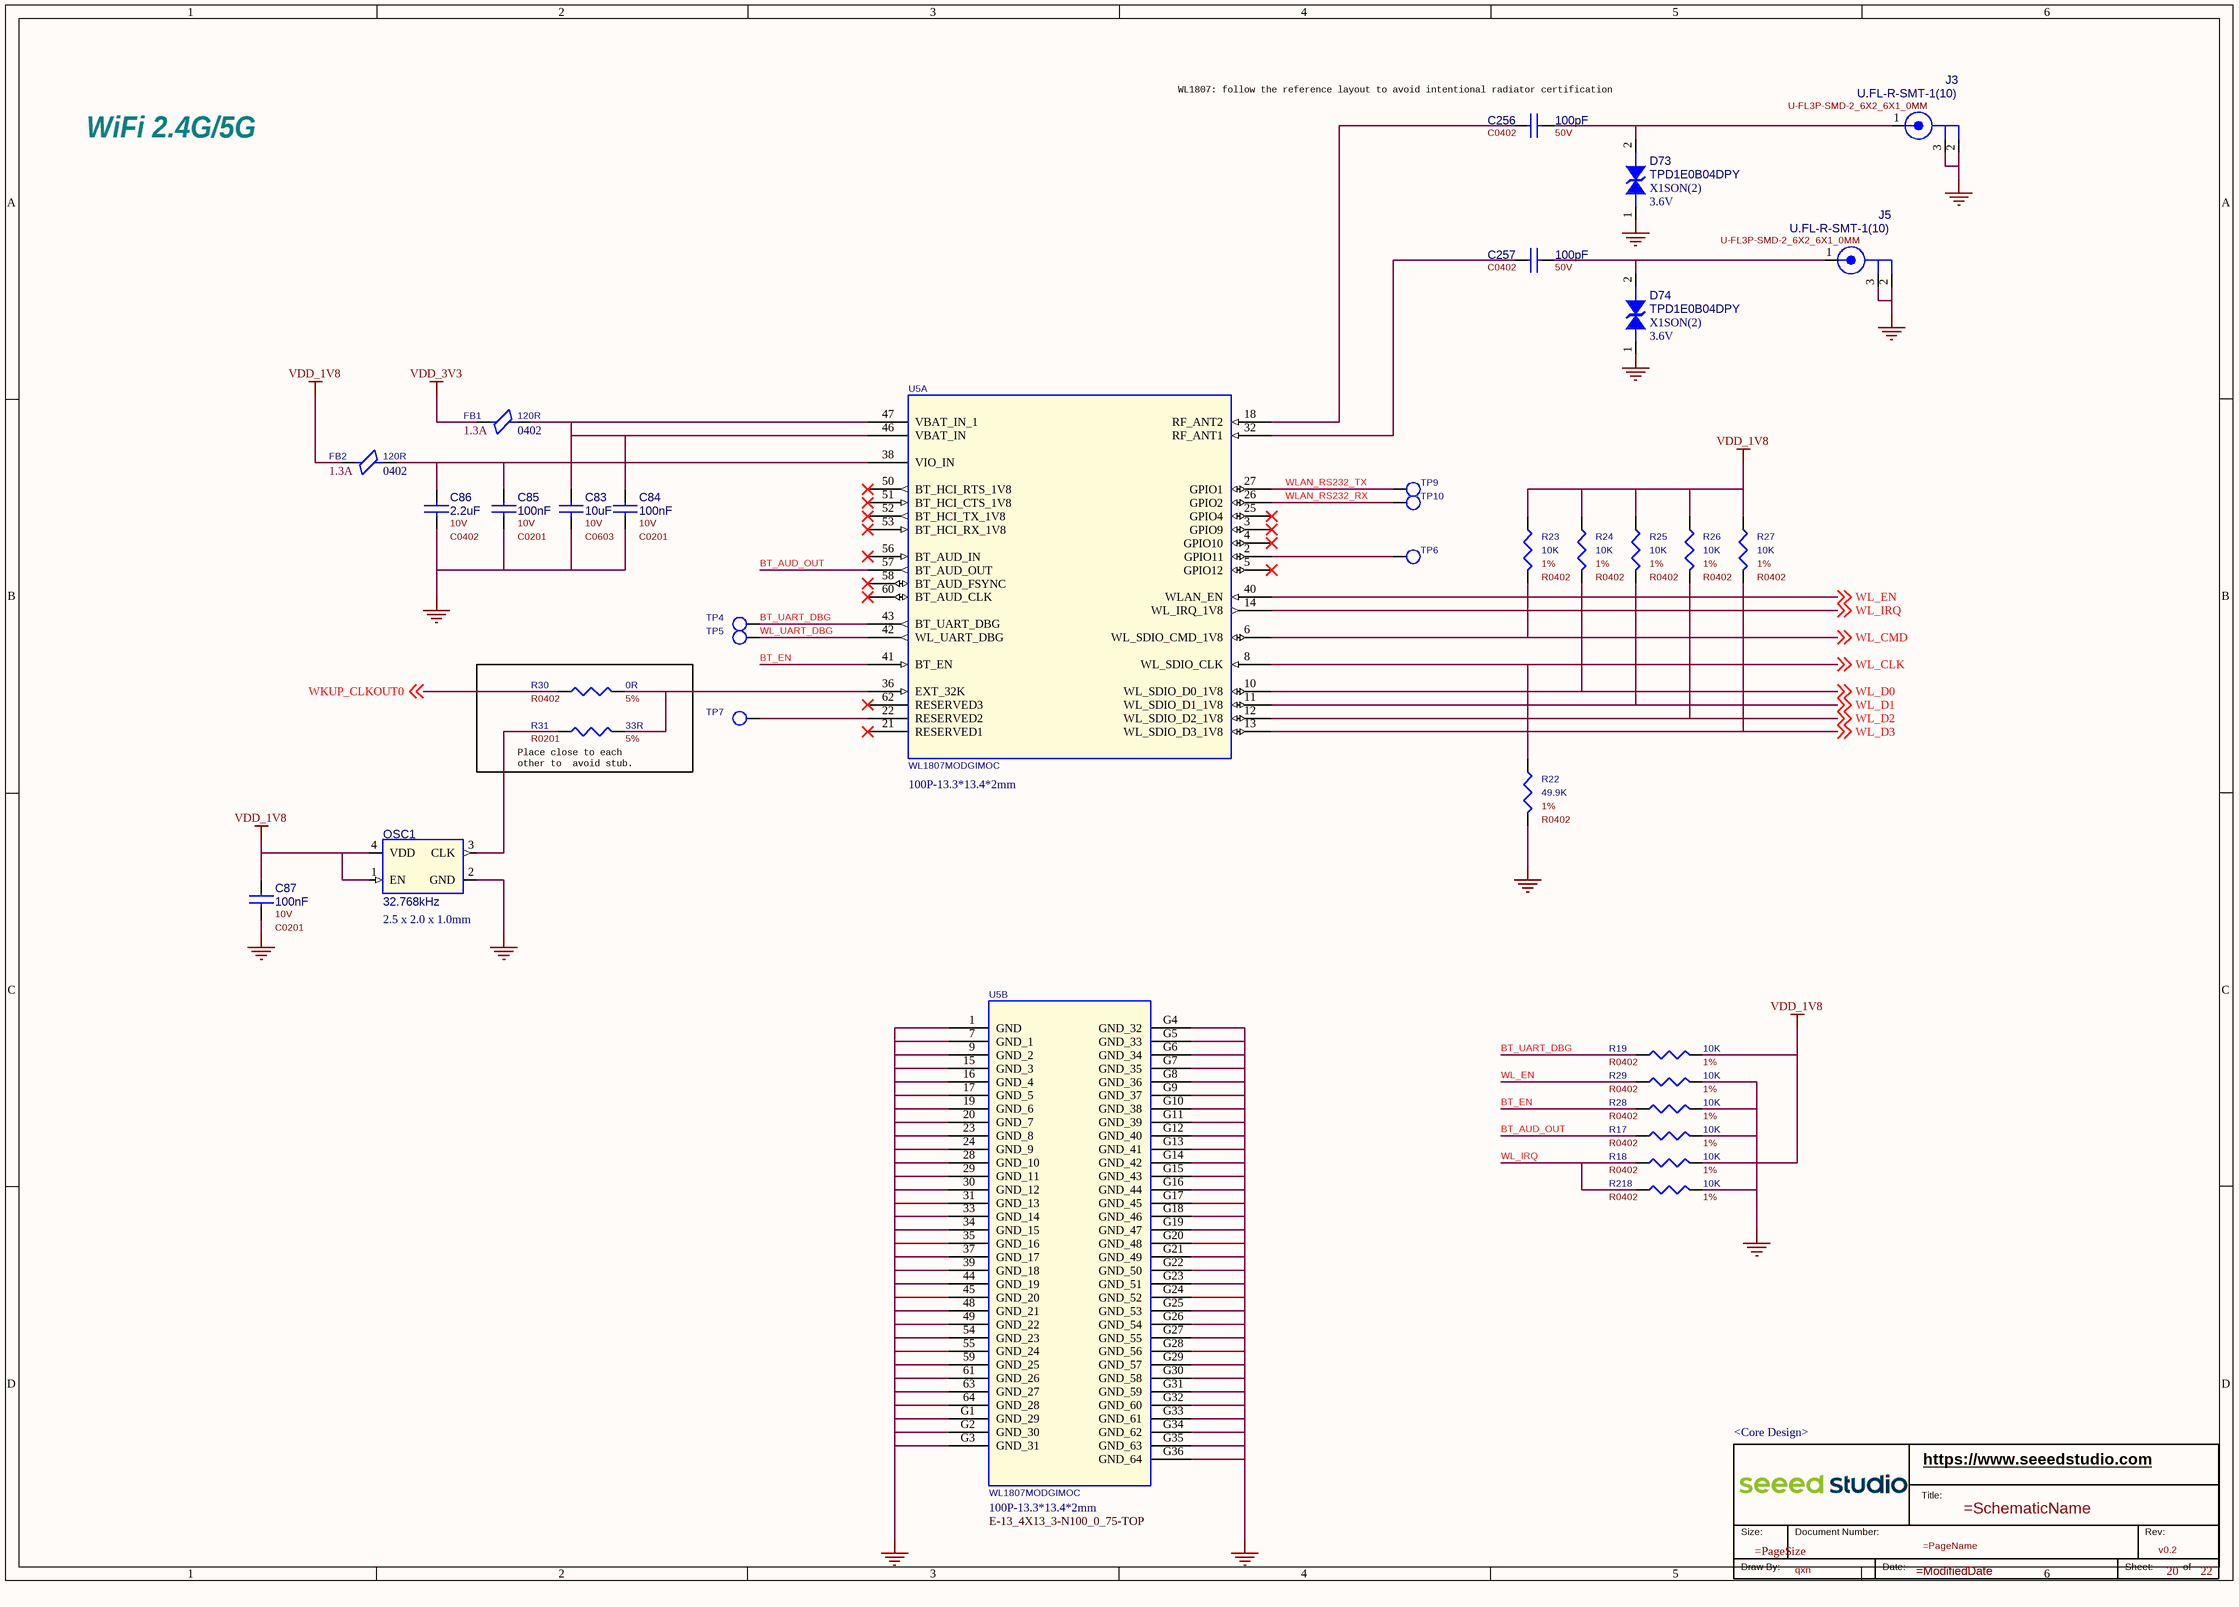
[diagram p19: 020_WiFi WL1807MOD.SchDoc]

### Parts
(Parts that share a designator on the sheet are numbered #1, #2 ... from top to bottom, then left to right.)
*#20  RevCode: v0.2  Page Number: 20  Page Count: 22  Drawing: qxn  Variant Name: <Core Design>  (hidden comment: Seeed Title)  (graphical)
C83  value 10uF  Rating: 10V  [C0603]  (hidden comment: CC)
C84  value 100nF  Rating: 10V  [C0201]  (hidden comment: CC)
C85  value 100nF  Rating: 10V  [C0201]  (hidden comment: CC)
C86  value 2.2uF  Rating: 10V  [C0402]  (hidden comment: CC)
C87  value 100nF  Rating: 10V  [C0201]  (hidden comment: CC)
C256  value 100pF  Rating: 50V  [C0402]  (hidden comment: CC)
C257  value 100pF  Rating: 50V  [C0402]  (hidden comment: CC)
D73  value TPD1E0B04DPY  Package Size: X1SON(2)  Rated Voltage: 3.6V  [x1son2_0d65_1x0_6x0_45mm]  (hidden comment: DIODE TVS BI-DIR)
D74  value TPD1E0B04DPY  Package Size: X1SON(2)  Rated Voltage: 3.6V  [x1son2_0d65_1x0_6x0_45mm]  (hidden comment: DIODE TVS BI-DIR)
FB1  value 120R  Rating: 1.3A  Package Size: 0402  [L0402]  (hidden comment: FB)
FB2  value 120R  Rating: 1.3A  Package Size: 0402  [L0402]  (hidden comment: FB)
J3  value U.FL-R-SMT-1(10)  [U-FL3P-SMD-2_6X2_6X1_0MM]  (hidden comment: RF ANT 3P)
J5  value U.FL-R-SMT-1(10)  [U-FL3P-SMD-2_6X2_6X1_0MM]  (hidden comment: RF ANT 3P)
OSC1  value 32.768kHz  Package Size: 2.5 x 2.0 x 1.0mm  [X4-SMD-2_5X2_0X1_0MM]  (hidden comment: OSC_4P)
R17  value 10K  Rating: 1%  [R0402]  (hidden comment: R)
R18  value 10K  Rating: 1%  [R0402]  (hidden comment: R)
R19  value 10K  Rating: 1%  [R0402]  (hidden comment: R)
R22  value 49.9K  Rating: 1%  [R0402]  (hidden comment: R)
R23  value 10K  Rating: 1%  [R0402]  (hidden comment: R)
R24  value 10K  Rating: 1%  [R0402]  (hidden comment: R)
R25  value 10K  Rating: 1%  [R0402]  (hidden comment: R)
R26  value 10K  Rating: 1%  [R0402]  (hidden comment: R)
R27  value 10K  Rating: 1%  [R0402]  (hidden comment: R)
R28  value 10K  Rating: 1%  [R0402]  (hidden comment: R)
R29  value 10K  Rating: 1%  [R0402]  (hidden comment: R)
R30  value 0R  Rating: 5%  [R0402]  (hidden comment: R)
R31  value 33R  Rating: 5%  [R0201]  (hidden comment: R)
R218  value 10K  Rating: 1%  [R0402]  (hidden comment: R)
TP4  Test Point  [tp1-8040]  (value not drawn)
TP5  Test Point  [tp1-8040]  (value not drawn)
TP6  Test Point  [tp1-8040]  (value not drawn)
TP7  Test Point  [tp1-8040]  (value not drawn)
TP9  Test Point  [tp1-8040]  (value not drawn)
TP10  Test Point  [tp1-8040]  (value not drawn)
U5  value WL1807MODGIMOC  Package Size: 100P-13.3*13.4*2mm  [E-13_4X13_3-N100_0_75-TOP]  (hidden comment: WL1807MOD)  (parts A,B of 2)

### Nets
GND: C83.2 C84.2 C85.2 C86.2 C87.2 D73.1 D74.1 J3.2(SHIELD1) J3.3(SHIELD2) J5.2(SHIELD1) J5.3(SHIELD2) OSC1.2(GND) R17.2 R22.2 R28.2 R29.2 R218.2 U5.1(GND) U5.7(GND_1) U5.9(GND_2) U5.15(GND_3) U5.16(GND_4) U5.17(GND_5) U5.19(GND_6) U5.20(GND_7) U5.23(GND_8) U5.24(GND_9) U5.28(GND_10) U5.29(GND_11) U5.30(GND_12) U5.31(GND_13) U5.33(GND_14) U5.34(GND_15) U5.35(GND_16) U5.37(GND_17) U5.39(GND_18) U5.44(GND_19) U5.45(GND_20) U5.48(GND_21) U5.49(GND_22) U5.54(GND_23) U5.55(GND_24) U5.59(GND_25) U5.61(GND_26) U5.63(GND_27) U5.64(GND_28) U5.G1(GND_29) U5.G2(GND_30) U5.G3(GND_31) U5.G4(GND_32) U5.G5(GND_33) U5.G6(GND_34) U5.G7(GND_35) U5.G8(GND_36) U5.G9(GND_37) U5.G10(GND_38) U5.G11(GND_39) U5.G12(GND_40) U5.G13(GND_41) U5.G14(GND_42) U5.G15(GND_43) U5.G16(GND_44) U5.G17(GND_45) U5.G18(GND_46) U5.G19(GND_47) U5.G20(GND_48) U5.G21(GND_49) U5.G22(GND_50) U5.G23(GND_51) U5.G24(GND_52) U5.G25(GND_53) U5.G26(GND_54) U5.G27(GND_55) U5.G28(GND_56) U5.G29(GND_57) U5.G30(GND_58) U5.G31(GND_59) U5.G32(GND_60) U5.G33(GND_61) U5.G34(GND_62) U5.G35(GND_63) U5.G36(GND_64)
VDD_1V8: C87.1 FB2.1 OSC1.1(EN) OSC1.4(VDD) R18.2 R19.2 R23.1 R24.1 R25.1 R26.1 R27.1
VDD_3V3: FB1.1
BT_AUD_OUT: R17.1 U5.57(BT_AUD_OUT)
BT_EN: R28.1 U5.41(BT_EN)
BT_UART_DBG: R19.1 TP4.1(TP) U5.43(BT_UART_DBG)
WKUP_CLKOUT0: R30.1 ; off-sheet WKUP_CLKOUT0
WL_CLK: R22.1 U5.8(WL_SDIO_CLK) ; off-sheet WL_CLK
WL_CMD: R23.2 U5.6(WL_SDIO_CMD_1V8) ; off-sheet WL_CMD
WL_D0: R24.2 U5.10(WL_SDIO_D0_1V8) ; off-sheet WL_D0
WL_D1: R25.2 U5.11(WL_SDIO_D1_1V8) ; off-sheet WL_D1
WL_D2: R26.2 U5.12(WL_SDIO_D2_1V8) ; off-sheet WL_D2
WL_D3: R27.2 U5.13(WL_SDIO_D3_1V8) ; off-sheet WL_D3
WL_EN: R29.1 U5.40(WLAN_EN) ; off-sheet WL_EN
WL_IRQ: R18.1 R218.1 U5.14(WL_IRQ_1V8) ; off-sheet WL_IRQ
WL_UART_DBG: TP5.1(TP) U5.42(WL_UART_DBG)
WLAN_RS232_RX: TP10.1(TP) U5.26(GPIO2)
WLAN_RS232_TX: TP9.1(TP) U5.27(GPIO1)
NetC83_1: C83.1 C84.1 FB1.2 U5.46(VBAT_IN) U5.47(VBAT_IN_1)
NetC85_1: C85.1 C86.1 FB2.2 U5.38(VIO_IN)
NetC256_1: C256.1 U5.18(RF_ANT2)
NetC256_2: C256.2 D73.2 J3.1(CENTER)
NetC257_1: C257.1 U5.32(RF_ANT1)
NetC257_2: C257.2 D74.2 J5.1(CENTER)
NetOSC1_3: OSC1.3(CLK) R31.1
NetR30_2: R30.2 R31.2 U5.36(EXT_32K)
NetTP6_1: TP6.1(TP) U5.2(GPIO11)
NetTP7_1: TP7.1(TP) U5.22(RESERVED2)

Not connected (* = marked no-connect by the designer): U5 3(GPIO9)* 4(GPIO10)* 5(GPIO12)* 21(RESERVED1)* 25(GPIO4)* 50(BT_HCI_RTS_1V8)* 51(BT_HCI_CTS_1V8)* 52(BT_HCI_TX_1V8)* 53(BT_HCI_RX_1V8)* 56(BT_AUD_IN)* 58(BT_AUD_FSYNC)* 60(BT_AUD_CLK)* 62(RESERVED3)*

### Notes on the sheet
- (near C256) WL1807: follow the reference layout to avoid intentional radiator certification
- WiFi 2.4G/5G
- (near R31) Place close to each
  other to  avoid stub.
- (in symbol Seeed Title) https://www.seeedstudio.com; Title:; Size:; Document Number:; Rev:; Draw By:; Date:; Sheet:; of

### Library data of the parts
*#20 = Seeed Title: Company: Seeed Studio; WebSite: https://www.seeedstudio.com; Schematic Name: =SchematicName; Page Size: =PageSize; Page Name: =PageName; Page Create Date: May 29, 2006; Page Modify Date: =ModifiedDate
C83 = CC: CAP, Ceramic, SMD, 10uF, 10%, 10V, 0603; Part Reference: C83; Manufacturer PN: CC0603KRX5R6BB106; Manufacturer: YAGEO; Company Part Status: BeagleBone Carrier Board; CLASS: DISCRETE; Temperature Coefficient: X5R; PN: 302010103; PCB Footprint: C0603; Tolerance: 10%; Dielectric Type: Ceramic; Package Size: 0603
C84 = CC: CAP, Ceramic, SMD, 100nF, 10%, 10V, 0201; Part Reference: C84; Manufacturer PN: CC0201KRX5R6BB104; Manufacturer: YAGEO; Company Part Status: ODYSSEY-i.MX8M; CLASS: DISCRETE; Temperature Coefficient: X5R; PN: 302010271; PCB Footprint: C0201; Tolerance: 10%; Dielectric Type: Ceramic; Package Size: 0201
C85 = CC: CAP, Ceramic, SMD, 100nF, 10%, 10V, 0201; Part Reference: C85; Manufacturer PN: CC0201KRX5R6BB104; Manufacturer: YAGEO; Company Part Status: ODYSSEY-i.MX8M; CLASS: DISCRETE; Temperature Coefficient: X5R; PN: 302010271; PCB Footprint: C0201; Tolerance: 10%; Dielectric Type: Ceramic; Package Size: 0201
C86 = CC: CAP, Ceramic, SMD, 2.2uF, 10%, 10V, 0402; Part Reference: C86; Manufacturer PN: CC0402KRX5R6BB225; Manufacturer: YAGEO; Company Part Status: BeagleConnect_Robotics_Joystick; CLASS: DISCRETE; Temperature Coefficient: X5R; PN: 302012819; PCB Footprint: C0402; Tolerance: 10%; Dielectric Type: Ceramic; Package Size: 0402
C87 = CC: CAP, Ceramic, SMD, 100nF, 10%, 10V, 0201; Part Reference: C87; Company Part Status: ODYSSEY-i.MX8M; Manufacturer: YAGEO; Manufacturer PN: CC0201KRX5R6BB104; SIGNAL_MODEL: DEFAULT_CAPACITOR_100000pF_1_2; PN: 302010271; Temperature Coefficient: X5R; CLASS: DISCRETE; PCB Footprint: C0201; Package Size: 0201; Dielectric Type: Ceramic; Tolerance: 10%
C256 = CC: CAP, Ceramic, SMD, 100pF, 5%, 50V, 0402; Part Reference: C256; Manufacturer PN: CC0402JRNPO9BN101; Company Part Status: Testo PoE; Manufacturer: YAGEO; CLASS: DISCRETE; PN: 302010012; PCB Footprint: C0402; Tolerance: 5%; Dielectric Type: Ceramic; Package Size: 0402; Manufacturer Part Number: CC0402JRNPO9BN101; Part Type: Ceramic; Status: Testo PoE; Temperature: -55¡ãC to 125¡ãC
C257 = CC: CAP, Ceramic, SMD, 100pF, 5%, 50V, 0402; Part Reference: C257; Manufacturer PN: CC0402JRNPO9BN101; Company Part Status: Testo PoE; Manufacturer: YAGEO; CLASS: DISCRETE; PN: 302010012; PCB Footprint: C0402; Tolerance: 5%; Dielectric Type: Ceramic; Package Size: 0402; Manufacturer Part Number: CC0402JRNPO9BN101; Part Type: Ceramic; Status: Testo PoE; Temperature: -55¡ãC to 125¡ãC
D73 = DIODE TVS BI-DIR: DIO, ESD, TPD1E0B04DPY, --, 3.6V, --, X1SON(2); Part Reference: D73; Company Part Status: BeaglePlay; Manufacturer: TI; Manufacturer PN: TPD1E0B04DPYR; PN: 304051038; CLASS: DISCRETE; PCB Footprint: x1son2_0d65_1x0_6x0_45mm
D74 = DIODE TVS BI-DIR: DIO, ESD, TPD1E0B04DPY, --, 3.6V, --, X1SON(2); Part Reference: D74; Company Part Status: BeaglePlay; Manufacturer: TI; Manufacturer PN: TPD1E0B04DPYR; PN: 304051038; CLASS: DISCRETE; PCB Footprint: x1son2_0d65_1x0_6x0_45mm
FB1 = FB: Ferrite Bead, 120R, , 1.3A, 0402; Part Reference: FB1; Manufacturer PN: BLM15PD121SN1D; Manufacturer: Murata; Company Part Status: BeagleBone Carrier Board; CLASS: DISCRETE; PN: 303030040; PCB Footprint: L0402
FB2 = FB: Ferrite Bead, 120R, , 1.3A, 0402; Part Reference: FB2; Manufacturer PN: BLM15PD121SN1D; Manufacturer: Murata; Company Part Status: BeagleBone Carrier Board; CLASS: DISCRETE; PN: 303030040; PCB Footprint: L0402
J3 = RF ANT 3P: CONN, RF Connector, 3P, SMD; Part Reference: J3; Manufacturer: HRS; Company Part Status: Seeed BeagleBone Green Gateway; CLASS: IO; PN: 320111077; PCB Footprint: U-FL3P-SMD-2_6X2_6X1_0MM; Manufacturer PN: U.FL-R-SMT-1(10); Package Size: 3P-L2.6*W2.6*H1.25mm
J5 = RF ANT 3P: CONN, RF Connector, 3P, SMD; Part Reference: J5; Company Part Status: Seeed BeagleBone Green Gateway; Manufacturer: HRS; PN: 320111077; CLASS: IO; PCB Footprint: U-FL3P-SMD-2_6X2_6X1_0MM; Package Size: 3P-L2.6*W2.6*H1.25mm; Manufacturer PN: U.FL-R-SMT-1(10)
OSC1 = OSC_4P: Oscillator, SMD, 32.768kHz, 30 ppm, --; Part Reference: OSC1; Manufacturer PN: 1651-L3273-BTKQYA; Manufacturer: Interquip; Company Part Status: BeaglePlay; CLASS: DISCRETE; Frequency Tolerance: 30 ppm; PN: 306020821; PCB Footprint: X4-SMD-2_5X2_0X1_0MM
R17 = R: RES, Thick Film, 10K, 1%, 1/16W, SMD, 0402; Part Reference: R17; Company Part Status: BeagleBone Carrier Board; Manufacturer: YAGEO; Manufacturer PN: RC0402FR-0710KL; PN: 301010047; CLASS: DISCRETE; PCB Footprint: R0402; Package Size: 0402; Rated Power: 1/16W
R18 = R: RES, Thick Film, 10K, 1%, 1/16W, SMD, 0402; Part Reference: R18; Company Part Status: BeagleBone Carrier Board; Manufacturer: YAGEO; Manufacturer PN: RC0402FR-0710KL; PN: 301010047; CLASS: DISCRETE; PCB Footprint: R0402; Package Size: 0402; Rated Power: 1/16W
R19 = R: RES, Thick Film, 10K, 1%, 1/16W, SMD, 0402; Part Reference: R19; Company Part Status: BeagleBone Carrier Board; Manufacturer: YAGEO; Manufacturer PN: RC0402FR-0710KL; PN: 301010047; CLASS: DISCRETE; PCB Footprint: R0402; Package Size: 0402; Rated Power: 1/16W
R22 = R: RES, Thick Film, 49.9K, 1%, 1/16W, SMD, 0402; Part Reference: R22; Manufacturer: YAGEO; Manufacturer PN: RC0402FR-0749K9L; SIGNAL_MODEL: DEFAULT_RESISTOR_49900OHM_1_2; PN: 301010457; CLASS: DISCRETE; PCB Footprint: R0402; Package Size: 0402; Rated Power: 1/16W
R23 = R: RES, Thick Film, 10K, 1%, 1/16W, SMD, 0402; Part Reference: R23; Manufacturer PN: RC0402FR-0710KL; Manufacturer: YAGEO; Company Part Status: BeagleBone Carrier Board; CLASS: DISCRETE; PN: 301010047; PCB Footprint: R0402; Package Size: 0402; Rated Power: 1/16W
R24 = R: RES, Thick Film, 10K, 1%, 1/16W, SMD, 0402; Part Reference: R24; Manufacturer PN: RC0402FR-0710KL; Manufacturer: YAGEO; Company Part Status: BeagleBone Carrier Board; CLASS: DISCRETE; PN: 301010047; PCB Footprint: R0402; Package Size: 0402; Rated Power: 1/16W
R25 = R: RES, Thick Film, 10K, 1%, 1/16W, SMD, 0402; Part Reference: R25; Manufacturer PN: RC0402FR-0710KL; Manufacturer: YAGEO; Company Part Status: BeagleBone Carrier Board; CLASS: DISCRETE; PN: 301010047; PCB Footprint: R0402; Package Size: 0402; Rated Power: 1/16W
R26 = R: RES, Thick Film, 10K, 1%, 1/16W, SMD, 0402; Part Reference: R26; Manufacturer PN: RC0402FR-0710KL; Manufacturer: YAGEO; Company Part Status: BeagleBone Carrier Board; CLASS: DISCRETE; PN: 301010047; PCB Footprint: R0402; Package Size: 0402; Rated Power: 1/16W
R27 = R: RES, Thick Film, 10K, 1%, 1/16W, SMD, 0402; Part Reference: R27; Manufacturer PN: RC0402FR-0710KL; Manufacturer: YAGEO; Company Part Status: BeagleBone Carrier Board; CLASS: DISCRETE; PN: 301010047; PCB Footprint: R0402; Package Size: 0402; Rated Power: 1/16W
R28 = R: RES, Thick Film, 10K, 1%, 1/16W, SMD, 0402; Part Reference: R28; Company Part Status: BeagleBone Carrier Board; Manufacturer: YAGEO; Manufacturer PN: RC0402FR-0710KL; PN: 301010047; CLASS: DISCRETE; PCB Footprint: R0402; Package Size: 0402; Rated Power: 1/16W
R29 = R: RES, Thick Film, 10K, 1%, 1/16W, SMD, 0402; Part Reference: R29; Manufacturer PN: RC0402FR-0710KL; Manufacturer: YAGEO; Company Part Status: BeagleBone Carrier Board; CLASS: DISCRETE; PN: 301010047; PCB Footprint: R0402; Package Size: 0402; Rated Power: 1/16W
R30 = R: RES, Thick Film, 0R, 5%, 1/16W, SMD, 0402; Part Reference: R30; Manufacturer PN: RC0402JR-070RL; Manufacturer: YAGEO; Company Part Status: BeagleBone Carrier Board; CLASS: DISCRETE; PN: 301010000; PCB Footprint: R0402; Rated Power: 1/16W; Package Size: 0402
R31 = R: RES, Thick Film, 33R, 5%, 1/20W, SMD, 0201; Part Reference: R31; Company Part Status: BeagleBone Carrier Board; Manufacturer: YAGEO; Manufacturer PN: RC0201JR-0733RL; PN: 301010675; CLASS: DISCRETE; PCB Footprint: R0201; Package Size: 0201; Rated Power: 1/20W
R218 = R: RES, Thick Film, 10K, 1%, 1/16W, SMD, 0402; Part Reference: R218; Company Part Status: BeagleBone Carrier Board; Manufacturer: YAGEO; Manufacturer PN: RC0402FR-0710KL; PN: 301010047; CLASS: DISCRETE; PCB Footprint: R0402; Package Size: 0402; Rated Power: 1/16W
TP4 = Test Point: MISC, Test Point, Test Point, SMD, TP35S_SMD; Part Reference: TP4; Company Part Status: Mini-Gateway; ASSY: DNP; CLASS: DISCRETE; PCB Footprint: TP35S_SMD; Value: Test Point; PN: TP35S_SMD; Package Size: TP35S_SMD
TP5 = Test Point: MISC, Test Point, Test Point, SMD, TP35S_SMD; Part Reference: TP5; Company Part Status: Mini-Gateway; ASSY: DNP; CLASS: DISCRETE; PCB Footprint: TP35S_SMD; Value: Test Point; PN: TP35S_SMD; Package Size: TP35S_SMD
TP6 = Test Point: MISC, Test Point, Test Point, SMD, TP35S_SMD; Part Reference: TP6; Company Part Status: Mini-Gateway; ASSY: DNP; CLASS: DISCRETE; PCB Footprint: TP35S_SMD; Value: Test Point; Package Size: TP35S_SMD; PN: TP35S_SMD
TP7 = Test Point: MISC, Test Point, Test Point, SMD, TP35S_SMD; Part Reference: TP7; Company Part Status: Mini-Gateway; ASSY: DNP; CLASS: DISCRETE; PCB Footprint: TP35S_SMD; Value: Test Point; PN: TP35S_SMD; Package Size: TP35S_SMD
TP9 = Test Point: MISC, Test Point, Test Point, SMD, TP35S_SMD; Part Reference: TP9; Company Part Status: Mini-Gateway; ASSY: DNP; CLASS: DISCRETE; PCB Footprint: TP35S_SMD; Value: Test Point; Package Size: TP35S_SMD; PN: TP35S_SMD
TP10 = Test Point: MISC, Test Point, Test Point, SMD, TP35S_SMD; Part Reference: TP10; Company Part Status: Mini-Gateway; ASSY: DNP; CLASS: DISCRETE; PCB Footprint: TP35S_SMD; Value: Test Point; Package Size: TP35S_SMD; PN: TP35S_SMD
U5 = WL1807MOD: IC, Modules, WiFi, WL1807MODGIMOC, 100P-13.3*13.4*2mm; Part Reference: U5; Manufacturer PN: WL1807MODGIMOCR; Manufacturer: TI; Company Part Status: BeaglePlay; FPLIST: E-13_4X13_3-N100_0_75-TOP,qfm100_0d7_13_3x13_4x2mm; PN: 317990527; PCB Footprint: E-13_4X13_3-N100_0_75-TOP; CLASS: IC